# Altium project ZoM-Model-A.PrjPCB
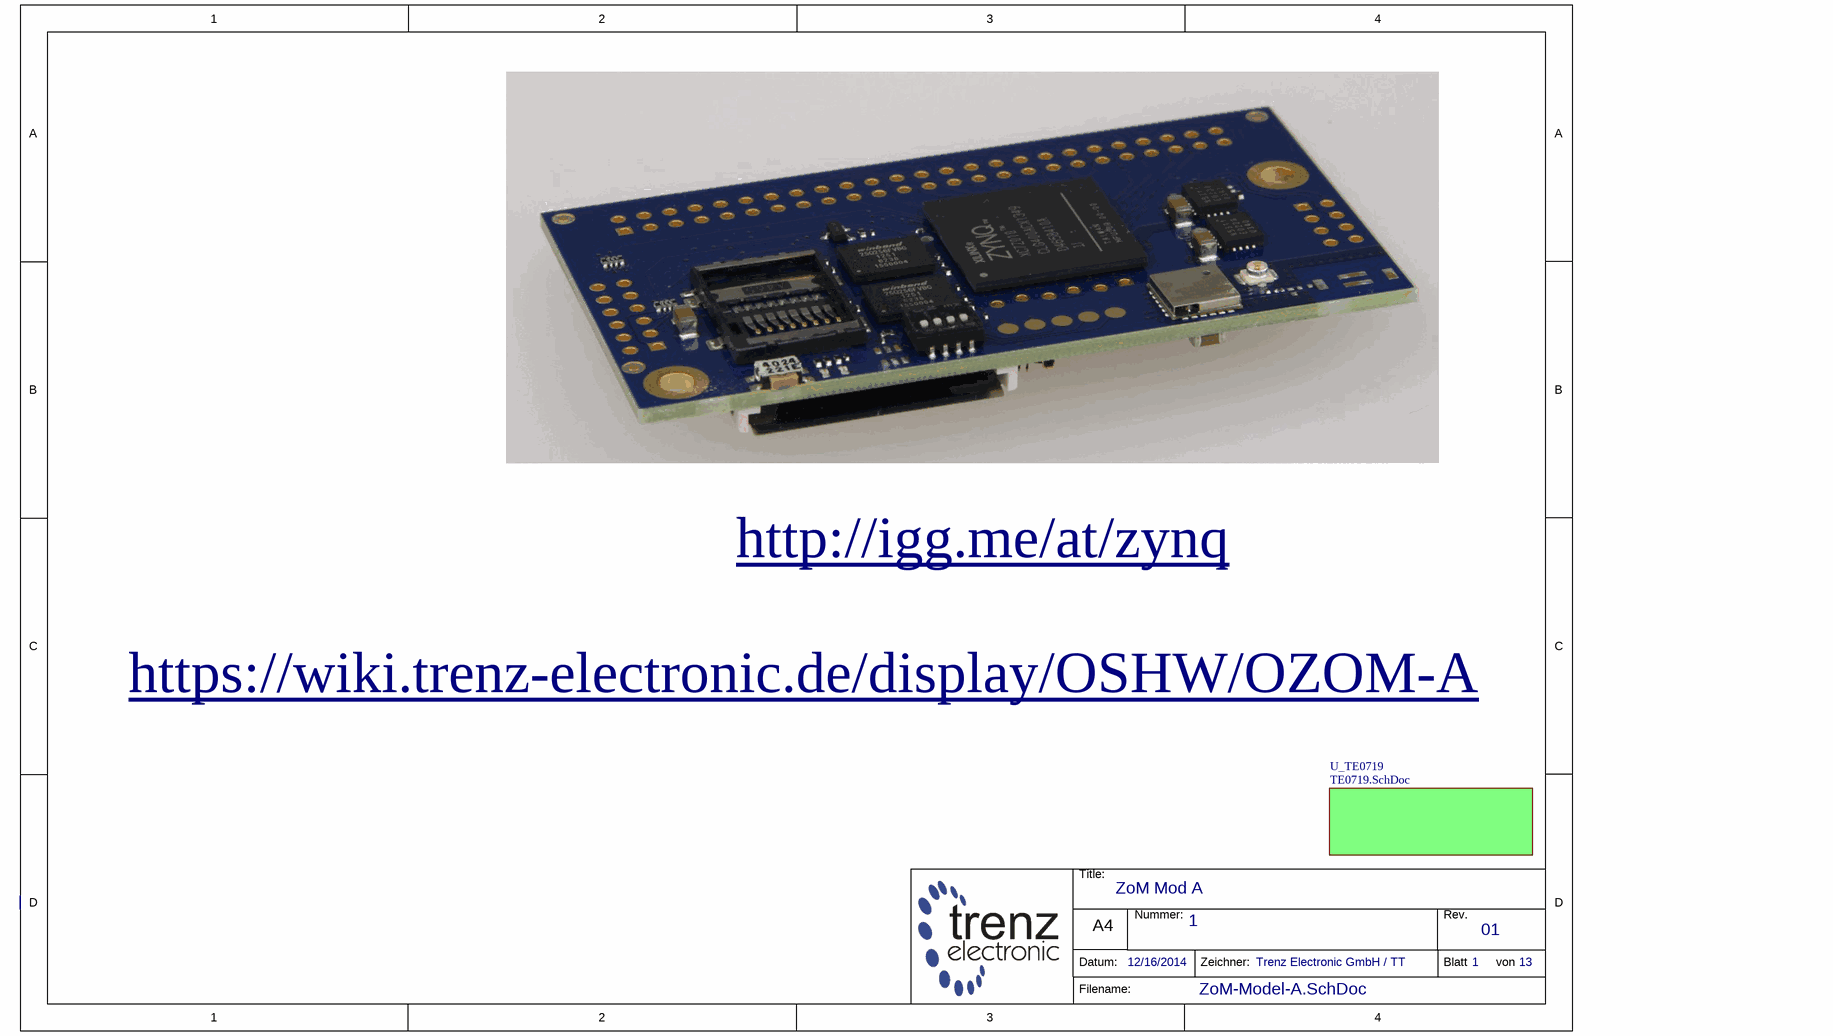
[diagram p0: ZoM-Model-A.SchDoc]
12 sheets, 136 parts. Net scope: global (net labels, ports and power ports of the same name join across sheets).
Board file: ZoM-Model-A.PcbDoc
Sheets:
  ZoM-Model-A.SchDoc
    U_TE0719 = TE0719.SchDoc
      U_FPGA = FPGA.SchDoc
        U_FPGA-Power = FPGA-Power.SchDoc
        U_FPGA-Misc = FPGA-Misc.SchDoc
        U_B13 = B13.SchDoc
        U_B34 = B34.SchDoc
        U_B35 = B35.SchDoc
        U_PS-DDR = PS-DDR.SchDoc
        U_PS_MIO = PS_MIO.SchDoc
      U_OBPeripheral = OBPeripheral.SchDoc
      U_POWER = POWER.SchDoc

## Sheet ZoM-Model-A.SchDoc: ZoM Mod A
size A4; Organization: Trenz Electronic GmbH / TT; DocumentNumber: 1; Revision: 01; SheetNumber: 1; SheetTotal: 13; Date: 12/16/2014

### Sub-sheets
U_TE0719 = TE0719.SchDoc: no entries

### Notes on the sheet
- http://igg.me/at/zynq
- https://wiki.trenz-electronic.de/display/OSHW/OZOM-A
- Title:
- Nummer:
- Rev.
- Datum:
- A4
- Zeichner:
- Blatt
- von
- Filename:

## Sheet TE0719.SchDoc: ZoM Mod A - Connectors
size A4; Organization: Trenz Electronic GmbH / TT; DocumentNumber: 2; Revision: 01; SheetNumber: 2; SheetTotal: 13; Date: 12/16/2014
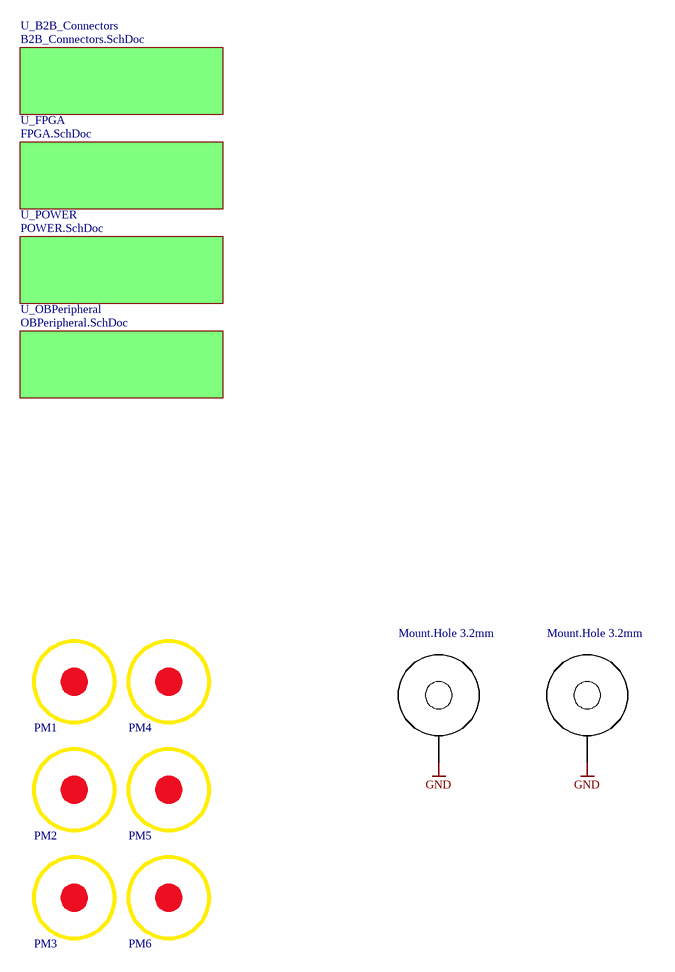
[diagram p1: TE0719.SchDoc]

### Parts
H1  Mount.Hole 3.2mm  [MHole3_2mm]  (no BOM)
H4  Mount.Hole 3.2mm  [MHole3_2mm]  (no BOM)
PM1  FIDU-DOT - small  [FIDU-DOT - small]  (value not drawn)
PM2  FIDU-DOT - small  [FIDU-DOT - small]  (value not drawn)
PM3  FIDU-DOT - small  [FIDU-DOT - small]  (value not drawn)
PM4  FIDU-DOT - small  [FIDU-DOT - small]  (value not drawn)
PM5  FIDU-DOT - small  [FIDU-DOT - small]  (value not drawn)
PM6  FIDU-DOT - small  [FIDU-DOT - small]  (value not drawn)

### Sub-sheets
U_B2B_Connectors = B2B_Connectors.SchDoc (file not in this document): no entries
U_FPGA = FPGA.SchDoc: no entries
U_OBPeripheral = OBPeripheral.SchDoc: no entries
U_POWER = POWER.SchDoc: no entries

### Nets
GND: H1.1 H4.1

### Notes on the sheet
- Title:
- Nummer:
- Rev.
- Datum:
- A4
- Zeichner:
- Blatt
- von
- Filename:

### Library data of the parts
H1 H4 = 22898: AN: 22898; Mixed: THT
PM1-PM6 = 22905: AN: 22905; Mixed: FIDU

## Sheet FPGA.SchDoc: ZoM Mod A - FPGA
size A4; Organization: Trenz Electronic GmbH; DocumentNumber: 5; Revision: 01; SheetNumber: 5; SheetTotal: 13; Date: 12/16/2014
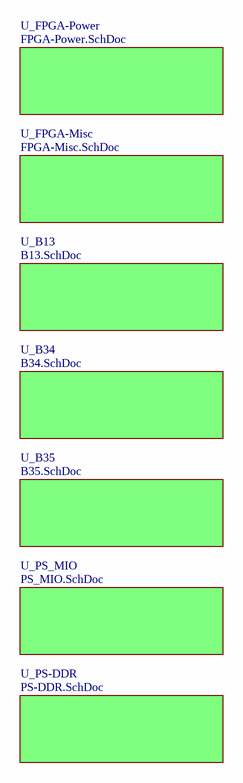
[diagram p2: FPGA.SchDoc]

### Sub-sheets
U_B13 = B13.SchDoc: no entries
U_B34 = B34.SchDoc: no entries
U_B35 = B35.SchDoc: no entries
U_FPGA-Misc = FPGA-Misc.SchDoc: no entries
U_FPGA-Power = FPGA-Power.SchDoc: no entries
U_PS-DDR = PS-DDR.SchDoc: no entries
U_PS_MIO = PS_MIO.SchDoc: no entries

### Notes on the sheet
- Title:
- Number:
- Rev.
- Date:
- A4
- Copyright:
- Page
- of
- Filename:

## Sheet FPGA-Power.SchDoc: ZoM Mod A - FPGA Power
size A4; Organization: Trenz Electronic GmbH / TT; DocumentNumber: 12; Revision: 01; SheetNumber: 12; SheetTotal: 13; Date: 12/16/2014
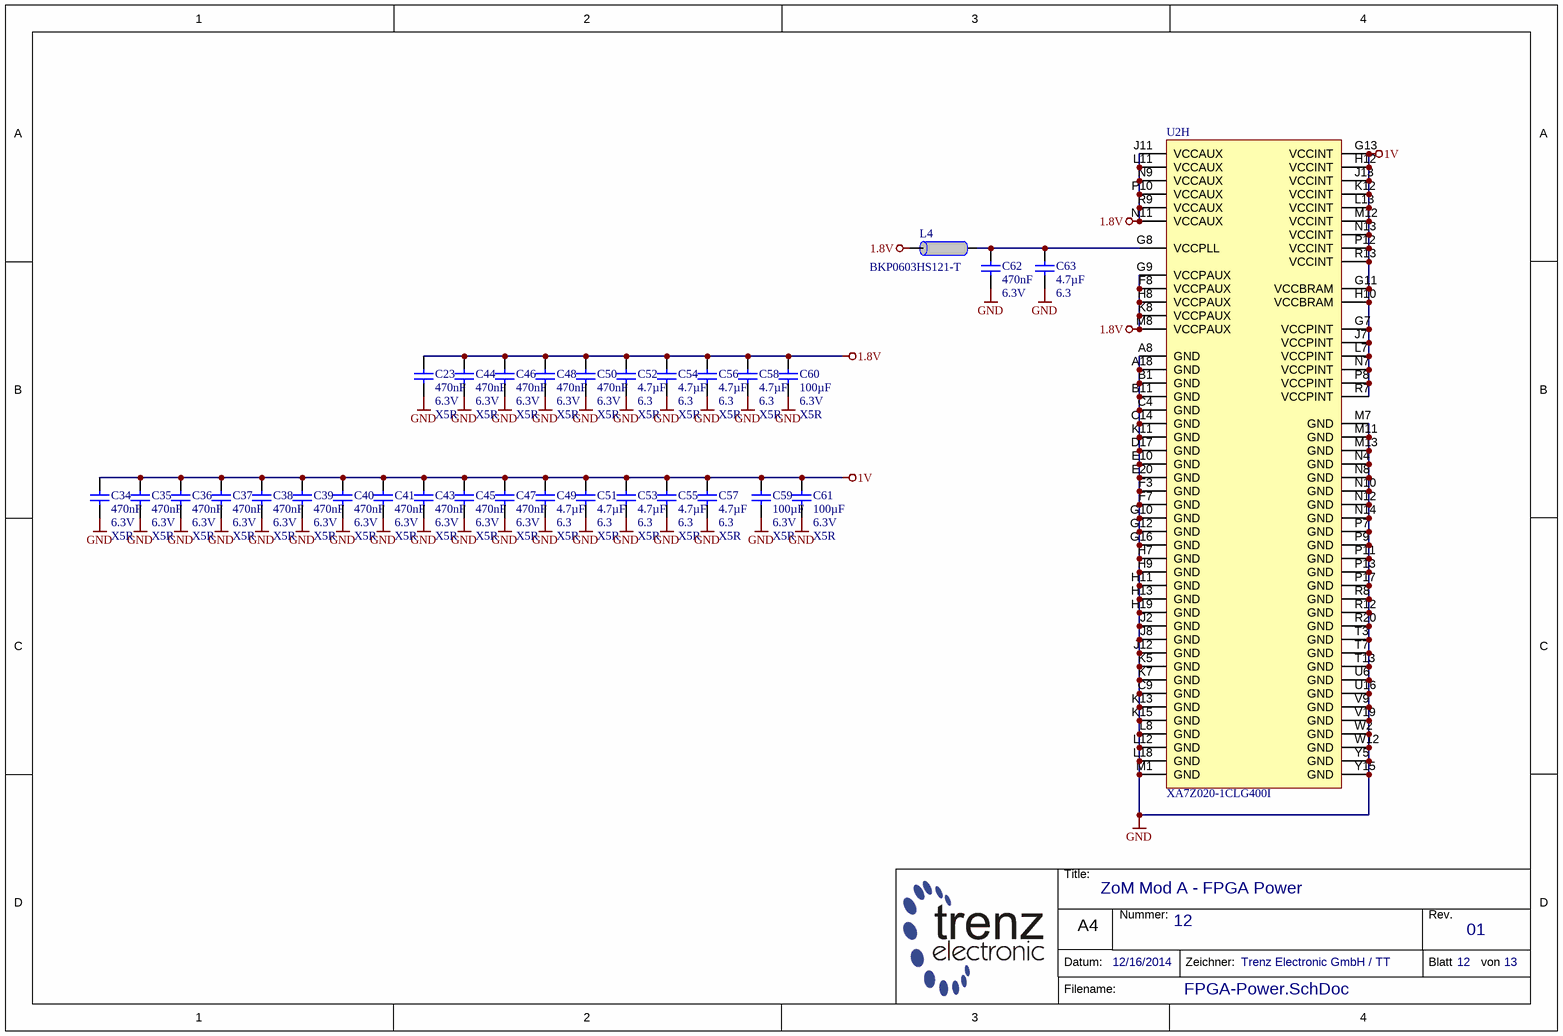
[diagram p3: FPGA-Power.SchDoc]

### Parts
C23  470nF  Voltage: 6.3V  Technology: X5R  [CAPC0603X33N]
C34  470nF  Voltage: 6.3V  Technology: X5R  [CAPC0603X33N]
C35  470nF  Voltage: 6.3V  Technology: X5R  [CAPC0603X33N]
C36  470nF  Voltage: 6.3V  Technology: X5R  [CAPC0603X33N]
C37  470nF  Voltage: 6.3V  Technology: X5R  [CAPC0603X33N]
C38  470nF  Voltage: 6.3V  Technology: X5R  [CAPC0603X33N]
C39  470nF  Voltage: 6.3V  Technology: X5R  [CAPC0603X33N]
C40  470nF  Voltage: 6.3V  Technology: X5R  [CAPC0603X33N]
C41  470nF  Voltage: 6.3V  Technology: X5R  [CAPC0603X33N]
C43  470nF  Voltage: 6.3V  Technology: X5R  [CAPC0603X33N]
C44  470nF  Voltage: 6.3V  Technology: X5R  [CAPC0603X33N]
C45  470nF  Voltage: 6.3V  Technology: X5R  [CAPC0603X33N]
C46  470nF  Voltage: 6.3V  Technology: X5R  [CAPC0603X33N]
C47  470nF  Voltage: 6.3V  Technology: X5R  [CAPC0603X33N]
C48  470nF  Voltage: 6.3V  Technology: X5R  [CAPC0603X33N]
C49  4.7µF  Voltage: 6.3  Technology: X5R  [CAPC1005X60N]
C50  470nF  Voltage: 6.3V  Technology: X5R  [CAPC0603X33N]
C51  4.7µF  Voltage: 6.3  Technology: X5R  [CAPC1005X60N]
C52  4.7µF  Voltage: 6.3  Technology: X5R  [CAPC1005X60N]
C53  4.7µF  Voltage: 6.3  Technology: X5R  [CAPC1005X60N]
C54  4.7µF  Voltage: 6.3  Technology: X5R  [CAPC1005X60N]
C55  4.7µF  Voltage: 6.3  Technology: X5R  [CAPC1005X60N]
C56  4.7µF  Voltage: 6.3  Technology: X5R  [CAPC1005X60N]
C57  4.7µF  Voltage: 6.3  Technology: X5R  [CAPC1005X60N]
C58  4.7µF  Voltage: 6.3  Technology: X5R  [CAPC1005X60N]
C59  100µF  Voltage: 6.3V  Technology: X5R  [CAPC3216X180N]
C60  100µF  Voltage: 6.3V  Technology: X5R  [CAPC3216X180N]
C61  100µF  Voltage: 6.3V  Technology: X5R  [CAPC3216X180N]
C62  470nF  Voltage: 6.3V  [CAPC0603X33N]
C63  4.7µF  Voltage: 6.3  [CAPC1005X60N]
L4  BKP0603HS121-T  [INDC0603X33N]
U2  XA7Z020-1CLG400I  [BGA400C80P20X20_1700X1700X160N]  (part H of 8)

### Nets
1.8V: C23.1 C44.1 C46.1 C48.1 C50.1 C52.1 C54.1 C56.1 C58.1 C60.2 L4.2 U2.F8(VCCPAUX) U2.G9(VCCPAUX) U2.H8(VCCPAUX) U2.J11(VCCAUX) U2.K8(VCCPAUX) U2.L11(VCCAUX) U2.M8(VCCPAUX) U2.N9(VCCAUX) U2.N11(VCCAUX) U2.P10(VCCAUX) U2.R9(VCCAUX)
1V: C34.1 C35.1 C36.1 C37.1 C38.1 C39.1 C40.1 C41.1 C43.1 C45.1 C47.1 C49.1 C51.1 C53.1 C55.1 C57.1 C59.1 C61.1 U2.G7(VCCPINT) U2.G11(VCCBRAM) U2.G13(VCCINT) U2.H10(VCCBRAM) U2.H12(VCCINT) U2.J7(VCCPINT) U2.J13(VCCINT) U2.K12(VCCINT) U2.L7(VCCPINT) U2.L13(VCCINT) U2.M12(VCCINT) U2.N7(VCCPINT) U2.N13(VCCINT) U2.P8(VCCPINT) U2.P12(VCCINT) U2.R7(VCCPINT) U2.R13(VCCINT)
GND: C23.2 C34.2 C35.2 C36.2 C37.2 C38.2 C39.2 C40.2 C41.2 C43.2 C44.2 C45.2 C46.2 C47.2 C48.2 C49.2 C50.2 C51.2 C52.2 C53.2 C54.2 C55.2 C56.2 C57.2 C58.2 C59.2 C60.1 C61.2 C62.2 C63.2 U2.A8(GND) U2.A18(GND) U2.B1(GND) U2.B11(GND) U2.C4(GND) U2.C9(GND) U2.C14(GND) U2.D17(GND) U2.E10(GND) U2.E20(GND) U2.F3(GND) U2.F7(GND) U2.G10(GND) U2.G12(GND) U2.G16(GND) U2.H7(GND) U2.H9(GND) U2.H11(GND) U2.H13(GND) U2.H19(GND) U2.J2(GND) U2.J8(GND) U2.J12(GND) U2.K5(GND) U2.K7(GND) U2.K11(GND) U2.K13(GND) U2.K15(GND) U2.L8(GND) U2.L12(GND) U2.L18(GND) U2.M1(GND) U2.M7(GND) U2.M11(GND) U2.M13(GND) U2.N4(GND) U2.N8(GND) U2.N10(GND) U2.N12(GND) U2.N14(GND) U2.P7(GND) U2.P9(GND) U2.P11(GND) U2.P13(GND) U2.P17(GND) U2.R8(GND) U2.R12(GND) U2.R20(GND) U2.T3(GND) U2.T7(GND) U2.T13(GND) U2.U6(GND) U2.U16(GND) U2.V9(GND) U2.V19(GND) U2.W2(GND) U2.W12(GND) U2.Y5(GND) U2.Y15(GND)
NetC62_1: C62.1 C63.1 L4.1 U2.G8(VCCPLL)

### Notes on the sheet
- Title:
- Nummer:
- Rev.
- Datum:
- A4
- Zeichner:
- Blatt
- von
- Filename:

### Library data of the parts
C23 C34-C41 C43-C48 C50 = 24921: KON 470nF X5R 6.3V SMD; AN: 24921; Value: 470n; Tolerance: 20%; Mixed: SMT; Preferred: Yes; Case: 0603 (0201)
C49 C51-C58 = 24719: KON 4.7µF 6.3V X5R SMD; AN: 24719; Value: 4.7u; Mixed: SMT; Preferred: Yes; Case: 1005 (0402)
C59-C61 = 23116: KON 100µF 6,3V X5R SMD; AN: 23116; Value: 100u; Mixed: SMT; Preferred: Yes; Case: 3216 (1206)
C62 = 24921: KON 470nF X5R 6.3V SMD; AN: 24921; Tolerance: 20%; Mixed: SMT; Value: 470n; Preferred: Yes; Technology: X5R; Case: 0603 (0201)
C63 = 24719: KON 4.7µF 6.3V X5R SMD; AN: 24719; Mixed: SMT; Value: 4.7u; Preferred: Yes; Technology: X5R; Case: 1005 (0402)
L4 = 25393: Ferritdurchführung SMD 0201; AN: 25393; Trenz-Stock: Yes; Mixed: SMT; Case: 0603 (0201); HelpURL: B:\AD\adlib\datasheet\MULTILAYER CHIP BEAD INDUCTORS BK; Preferred: Yes
U2 = 25981: AN: 25981; Mixed: SMT; Trenz-Stock: Yes; Case: CLG400; HelpURL: B:\AD\adlib\datasheet\XC7

## Sheet FPGA-Misc.SchDoc: ZoM Mod A - FPGA MIsc
size A4; Organization: Trenz Electronic GmbH / TT; DocumentNumber: 11; Revision: 01; SheetNumber: 11; SheetTotal: 13; Date: 12/16/2014
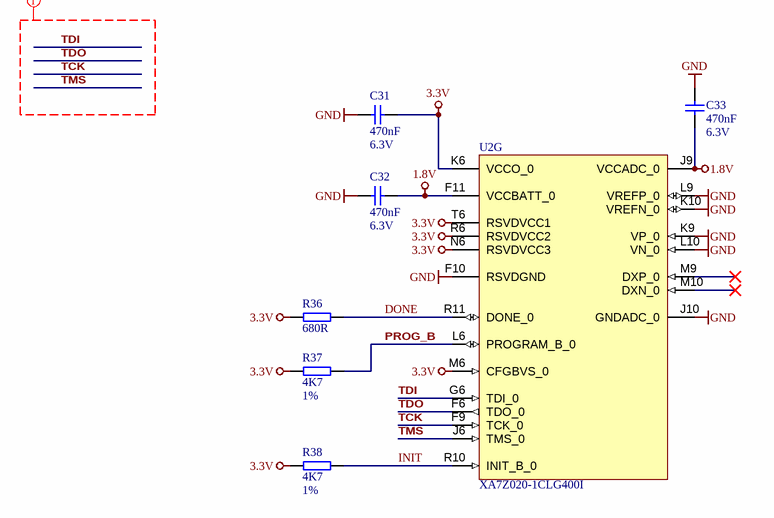
[diagram p4: FPGA-Misc.SchDoc]

### Parts
C31  470nF  Voltage: 6.3V  [CAPC0603X33N]
C32  470nF  Voltage: 6.3V  [CAPC0603X33N]
C33  470nF  Voltage: 6.3V  [CAPC0603X33N]
R36  680R  [RESC1005X40N]
R37  4K7  Tolerance: 1%  [RESC0603X26N]
R38  4K7  Tolerance: 1%  [RESC0603X26N]
U2  XA7Z020-1CLG400I  [BGA400C80P20X20_1700X1700X160N]  (part G of 8)

### Nets
1.8V: C32.2 C33.2 U2.F11(VCCBATT_0) U2.J9(VCCADC_0)
3.3V: C31.2 R36.1 R37.2 R38.2 U2.K6(VCCO_0) U2.M6(CFGBVS_0) U2.N6(RSVDVCC3) U2.R6(RSVDVCC2) U2.T6(RSVDVCC1)
GND: C31.1 C32.1 C33.1 U2.F10(RSVDGND) U2.J10(GNDADC_0) U2.K9(VP_0) U2.K10(VREFN_0) U2.L9(VREFP_0) U2.L10(VN_0)
DONE: R36.2 U2.R11(DONE_0)
INIT: R38.1 U2.R10(INIT_B_0)
PROG_B: R37.1 U2.L6(PROGRAM_B_0)
TCK: U2.F9(TCK_0)
TDI: U2.G6(TDI_0)
TDO: U2.F6(TDO_0)
TMS: U2.J6(TMS_0)

Not connected (* = marked no-connect by the designer): U2 M9(DXP_0)* M10(DXN_0)*

### Layout directives
net class JTAG: TCK, TDI, TDO, TMS

### Notes on the sheet
- Title:
- Nummer:
- Rev.
- Datum:
- A4
- Zeichner:
- Blatt
- von
- Filename:

### Library data of the parts
C31-C33 = 24921: as C23 on sheet FPGA-Power; Case: 0603 (0201); Technology: X5R
R36 = 22761: WID SMD 680R 1% 0,063W; AN: 22761; Value: 680; Mixed: SMT; Preferred: Yes; Case: 1005 (0402)
R37 R38 = 25242: WID SMD 4K7 1% 0,05W; AN: 25242; Value: 4.7K; Mixed: SMT; Preferred: Yes; Case: 0603 (0201); HelpURL: B:\AD\adlib\datasheet\R0201
U2 = 25981: AN: 25981; Mixed: SMT; Trenz-Stock: Yes; Case: CLG400; HelpURL: B:\AD\adlib\datasheet\XC7

## Sheet B13.SchDoc: ZoM Mod A - FPGA Bank 13
size A4; Organization: Trenz Electronic GmbH / TT; DocumentNumber: 6; Revision: 01; SheetNumber: 6; SheetTotal: 13; Date: 12/16/2014
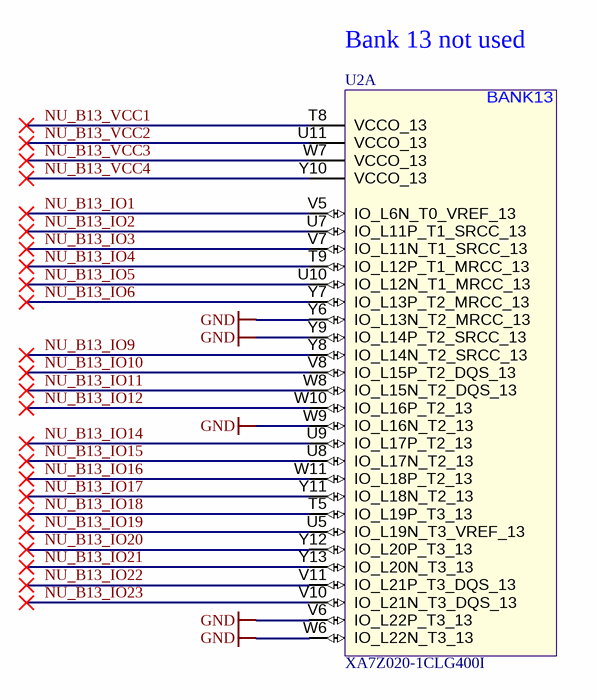
[diagram p5: B13.SchDoc]

### Parts
U2  XA7Z020-1CLG400I  [BGA400C80P20X20_1700X1700X160N]  (part A of 8)

### Nets
GND: U2.V6(IO_L22P_T3_13) U2.W6(IO_L22N_T3_13) U2.W9(IO_L16N_T2_13) U2.Y6(IO_L13N_T2_MRCC_13) U2.Y9(IO_L14P_T2_SRCC_13)
NU_B13_IO1: U2.V5(IO_L6N_T0_VREF_13)
NU_B13_IO2: U2.U7(IO_L11P_T1_SRCC_13)
NU_B13_IO3: U2.V7(IO_L11N_T1_SRCC_13)
NU_B13_IO4: U2.T9(IO_L12P_T1_MRCC_13)
NU_B13_IO5: U2.U10(IO_L12N_T1_MRCC_13)
NU_B13_IO6: U2.Y7(IO_L13P_T2_MRCC_13)
NU_B13_IO9: U2.Y8(IO_L14N_T2_SRCC_13)
NU_B13_IO10: U2.V8(IO_L15P_T2_DQS_13)
NU_B13_IO11: U2.W8(IO_L15N_T2_DQS_13)
NU_B13_IO12: U2.W10(IO_L16P_T2_13)
NU_B13_IO14: U2.U9(IO_L17P_T2_13)
NU_B13_IO15: U2.U8(IO_L17N_T2_13)
NU_B13_IO16: U2.W11(IO_L18P_T2_13)
NU_B13_IO17: U2.Y11(IO_L18N_T2_13)
NU_B13_IO18: U2.T5(IO_L19P_T3_13)
NU_B13_IO19: U2.U5(IO_L19N_T3_VREF_13)
NU_B13_IO20: U2.Y12(IO_L20P_T3_13)
NU_B13_IO21: U2.Y13(IO_L20N_T3_13)
NU_B13_IO22: U2.V11(IO_L21P_T3_DQS_13)
NU_B13_IO23: U2.V10(IO_L21N_T3_DQS_13)
NU_B13_VCC1: U2.T8(VCCO_13)
NU_B13_VCC2: U2.U11(VCCO_13)
NU_B13_VCC3: U2.W7(VCCO_13)
NU_B13_VCC4: U2.Y10(VCCO_13)

### Notes on the sheet
- Bank 13 not used
- Title:
- Nummer:
- Rev.
- Datum:
- A4
- Zeichner:
- Blatt
- von
- Filename:
- (in symbol 25981, part A) BANK13

### Library data of the parts
U2 = 25981: AN: 25981; Mixed: SMT; Trenz-Stock: Yes; Case: CLG400; HelpURL: B:\AD\adlib\datasheet\XC7

## Sheet B34.SchDoc: ZoM Mod A - FPGA Bank 34
size A4; Organization: Trenz Electronic GmbH / TT; DocumentNumber: 7; Revision: 01; SheetNumber: 7; SheetTotal: 13; Date: 12/16/2014
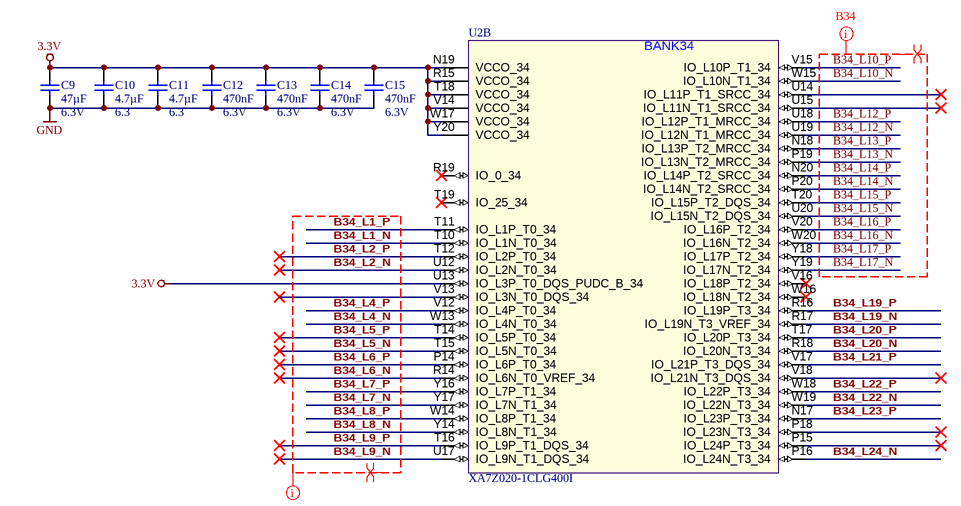
[diagram p6: B34.SchDoc]

### Parts
C9  47µF  Voltage: 6.3V  [CAPC3216X180N]
C10  4.7µF  Voltage: 6.3  [CAPC1005X60N]
C11  4.7µF  Voltage: 6.3  [CAPC1005X60N]
C12  470nF  Voltage: 6.3V  [CAPC0603X33N]
C13  470nF  Voltage: 6.3V  [CAPC0603X33N]
C14  470nF  Voltage: 6.3V  [CAPC0603X33N]
C15  470nF  Voltage: 6.3V  [CAPC0603X33N]
U2  XA7Z020-1CLG400I  [BGA400C80P20X20_1700X1700X160N]  (part B of 8)

### Nets
3.3V: C9.1 C10.1 C11.1 C12.1 C13.1 C14.1 C15.1 U2.N19(VCCO_34) U2.R15(VCCO_34) U2.T18(VCCO_34) U2.U13(IO_L3P_T0_DQS_PUDC_B_34) U2.V14(VCCO_34) U2.W17(VCCO_34) U2.Y20(VCCO_34)
GND: C9.2 C10.2 C11.2 C12.2 C13.2 C14.2 C15.2
B34_L1_N: U2.T10(IO_L1N_T0_34)
B34_L1_P: U2.T11(IO_L1P_T0_34)
B34_L2_N: U2.U12(IO_L2N_T0_34)
B34_L2_P: U2.T12(IO_L2P_T0_34)
B34_L4_N: U2.W13(IO_L4N_T0_34)
B34_L4_P: U2.V12(IO_L4P_T0_34)
B34_L5_N: U2.T15(IO_L5N_T0_34)
B34_L5_P: U2.T14(IO_L5P_T0_34)
B34_L6_N: U2.R14(IO_L6N_T0_VREF_34)
B34_L6_P: U2.P14(IO_L6P_T0_34)
B34_L7_N: U2.Y17(IO_L7N_T1_34)
B34_L7_P: U2.Y16(IO_L7P_T1_34)
B34_L8_N: U2.Y14(IO_L8N_T1_34)
B34_L8_P: U2.W14(IO_L8P_T1_34)
B34_L9_N: U2.U17(IO_L9N_T1_DQS_34)
B34_L9_P: U2.T16(IO_L9P_T1_DQS_34)
B34_L10_N: U2.W15(IO_L10N_T1_34)
B34_L10_P: U2.V15(IO_L10P_T1_34)
B34_L12_N: U2.U19(IO_L12N_T1_MRCC_34)
B34_L12_P: U2.U18(IO_L12P_T1_MRCC_34)
B34_L13_N: U2.P19(IO_L13N_T2_MRCC_34)
B34_L13_P: U2.N18(IO_L13P_T2_MRCC_34)
B34_L14_N: U2.P20(IO_L14N_T2_SRCC_34)
B34_L14_P: U2.N20(IO_L14P_T2_SRCC_34)
B34_L15_N: U2.U20(IO_L15N_T2_DQS_34)
B34_L15_P: U2.T20(IO_L15P_T2_DQS_34)
B34_L16_N: U2.W20(IO_L16N_T2_34)
B34_L16_P: U2.V20(IO_L16P_T2_34)
B34_L17_N: U2.Y19(IO_L17N_T2_34)
B34_L17_P: U2.Y18(IO_L17P_T2_34)
B34_L19_N: U2.R17(IO_L19N_T3_VREF_34)
B34_L19_P: U2.R16(IO_L19P_T3_34)
B34_L20_N: U2.R18(IO_L20N_T3_34)
B34_L20_P: U2.T17(IO_L20P_T3_34)
B34_L21_P: U2.V17(IO_L21P_T3_DQS_34)
B34_L22_N: U2.W19(IO_L22N_T3_34)
B34_L22_P: U2.W18(IO_L22P_T3_34)
B34_L23_P: U2.N17(IO_L23P_T3_34)
B34_L24_N: U2.P16(IO_L24N_T3_34)

Not connected (* = marked no-connect by the designer): U2 P15(IO_L24P_T3_34)* P18(IO_L23N_T3_34)* R19(IO_0_34)* T19(IO_25_34)* U14(IO_L11P_T1_SRCC_34)* U15(IO_L11N_T1_SRCC_34)* V13(IO_L3N_T0_DQS_34)* V16(IO_L18P_T2_34)* V18(IO_L21N_T3_DQS_34)* W16(IO_L18N_T2_34)*

### Layout directives
differential pair: B34_L1_N, B34_L1_P, B34_L2_N, B34_L2_P, B34_L4_N, B34_L4_P, B34_L5_N, B34_L5_P, B34_L6_N, B34_L6_P, B34_L7_N, B34_L7_P, B34_L8_N, B34_L8_P, B34_L9_N, B34_L9_P, B34_L10_N, B34_L10_P, B34_L12_N, B34_L12_P, B34_L13_N, B34_L13_P, B34_L14_N, B34_L14_P, B34_L15_N, B34_L15_P, B34_L16_N, B34_L16_P, B34_L17_N, B34_L17_P
net class B34: B34_L1_N, B34_L1_P, B34_L2_N, B34_L2_P, B34_L4_N, B34_L4_P, B34_L5_N, B34_L5_P, B34_L6_N, B34_L6_P, B34_L7_N, B34_L7_P, B34_L8_N, B34_L8_P, B34_L9_N, B34_L9_P, B34_L10_N, B34_L10_P, B34_L12_N, B34_L12_P, B34_L13_N, B34_L13_P, B34_L14_N, B34_L14_P, B34_L15_N, B34_L15_P, B34_L16_N, B34_L16_P, B34_L17_N, B34_L17_P

### Notes on the sheet
- Title:
- Nummer:
- Rev.
- Datum:
- A4
- Zeichner:
- Blatt
- von
- Filename:
- (in symbol 25981, part B) BANK34

### Library data of the parts
C9 = 24557: KON 47µF 6.3V  X5R SMD 20%; AN: 24557; Mixed: SMT; Value: 47u; Preferred: Yes; Technology: X5R; Case: 3216 (1206); Tolerance: 20%
C10 C11 = 24719: as C49 on sheet FPGA-Power; Case: 1005 (0402); Technology: X5R
C12-C15 = 24921: as C23 on sheet FPGA-Power; Case: 0603 (0201); Technology: X5R
U2 = 25981: AN: 25981; Mixed: SMT; Trenz-Stock: Yes; Case: CLG400; HelpURL: B:\AD\adlib\datasheet\XC7

## Sheet B35.SchDoc: ZoM Mod A - FPGA Bank 35
size A4; Organization: Trenz Electronic GmbH / TT; DocumentNumber: 8; Revision: 01; SheetNumber: 8; SheetTotal: 13; Date: 12/16/2014
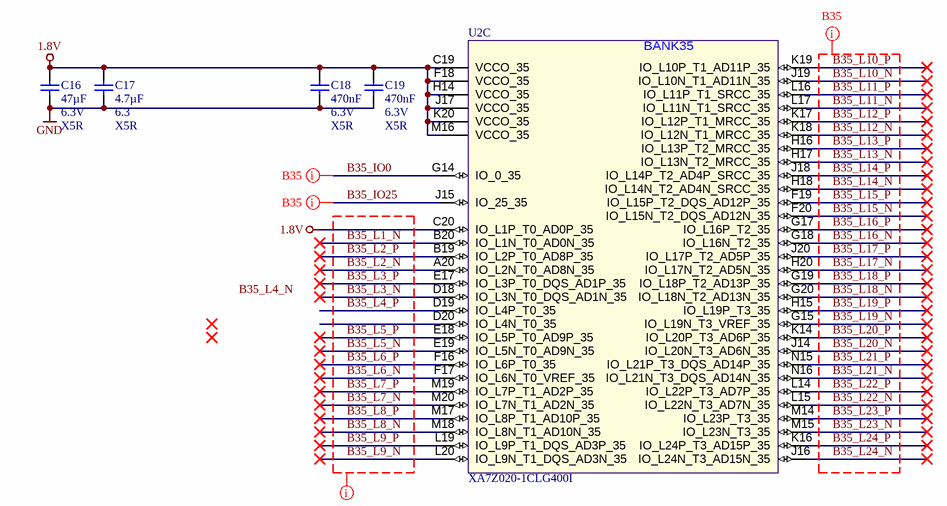
[diagram p7: B35.SchDoc]

### Parts
C16  47µF  Voltage: 6.3V  Technology: X5R  [CAPC3216X180N]
C17  4.7µF  Voltage: 6.3  Technology: X5R  [CAPC1005X60N]
C18  470nF  Voltage: 6.3V  Technology: X5R  [CAPC0603X33N]
C19  470nF  Voltage: 6.3V  Technology: X5R  [CAPC0603X33N]
U2  XA7Z020-1CLG400I  [BGA400C80P20X20_1700X1700X160N]  (part C of 8)

### Nets
1.8V: C16.1 C17.1 C18.1 C19.1 U2.C19(VCCO_35) U2.C20(IO_L1P_T0_AD0P_35) U2.F18(VCCO_35) U2.H14(VCCO_35) U2.J17(VCCO_35) U2.K20(VCCO_35) U2.M16(VCCO_35)
GND: C16.2 C17.2 C18.2 C19.2
B35_IO0: U2.G14(IO_0_35)
B35_IO25: U2.J15(IO_25_35)
B35_L1_N: U2.B20(IO_L1N_T0_AD0N_35)
B35_L2_N: U2.A20(IO_L2N_T0_AD8N_35)
B35_L2_P: U2.B19(IO_L2P_T0_AD8P_35)
B35_L3_N: U2.D18(IO_L3N_T0_DQS_AD1N_35)
B35_L3_P: U2.E17(IO_L3P_T0_DQS_AD1P_35)
B35_L4_P: U2.D19(IO_L4P_T0_35)
B35_L5_N: U2.E19(IO_L5N_T0_AD9N_35)
B35_L5_P: U2.E18(IO_L5P_T0_AD9P_35)
B35_L6_N: U2.F17(IO_L6N_T0_VREF_35)
B35_L6_P: U2.F16(IO_L6P_T0_35)
B35_L7_N: U2.M20(IO_L7N_T1_AD2N_35)
B35_L7_P: U2.M19(IO_L7P_T1_AD2P_35)
B35_L8_N: U2.M18(IO_L8N_T1_AD10N_35)
B35_L8_P: U2.M17(IO_L8P_T1_AD10P_35)
B35_L9_N: U2.L20(IO_L9N_T1_DQS_AD3N_35)
B35_L9_P: U2.L19(IO_L9P_T1_DQS_AD3P_35)
B35_L10_N: U2.J19(IO_L10N_T1_AD11N_35)
B35_L10_P: U2.K19(IO_L10P_T1_AD11P_35)
B35_L11_N: U2.L17(IO_L11N_T1_SRCC_35)
B35_L11_P: U2.L16(IO_L11P_T1_SRCC_35)
B35_L12_N: U2.K18(IO_L12N_T1_MRCC_35)
B35_L12_P: U2.K17(IO_L12P_T1_MRCC_35)
B35_L13_N: U2.H17(IO_L13N_T2_MRCC_35)
B35_L13_P: U2.H16(IO_L13P_T2_MRCC_35)
B35_L14_N: U2.H18(IO_L14N_T2_AD4N_SRCC_35)
B35_L14_P: U2.J18(IO_L14P_T2_AD4P_SRCC_35)
B35_L15_N: U2.F20(IO_L15N_T2_DQS_AD12N_35)
B35_L15_P: U2.F19(IO_L15P_T2_DQS_AD12P_35)
B35_L16_N: U2.G18(IO_L16N_T2_35)
B35_L16_P: U2.G17(IO_L16P_T2_35)
B35_L17_N: U2.H20(IO_L17N_T2_AD5N_35)
B35_L17_P: U2.J20(IO_L17P_T2_AD5P_35)
B35_L18_N: U2.G20(IO_L18N_T2_AD13N_35)
B35_L18_P: U2.G19(IO_L18P_T2_AD13P_35)
B35_L19_N: U2.G15(IO_L19N_T3_VREF_35)
B35_L19_P: U2.H15(IO_L19P_T3_35)
B35_L20_N: U2.J14(IO_L20N_T3_AD6N_35)
B35_L20_P: U2.K14(IO_L20P_T3_AD6P_35)
B35_L21_N: U2.N16(IO_L21N_T3_DQS_AD14N_35)
B35_L21_P: U2.N15(IO_L21P_T3_DQS_AD14P_35)
B35_L22_N: U2.L15(IO_L22N_T3_AD7N_35)
B35_L22_P: U2.L14(IO_L22P_T3_AD7P_35)
B35_L23_N: U2.M15(IO_L23N_T3_35)
B35_L23_P: U2.M14(IO_L23P_T3_35)
B35_L24_N: U2.J16(IO_L24N_T3_AD15N_35)
B35_L24_P: U2.K16(IO_L24P_T3_AD15P_35)

Not connected (* = marked no-connect by the designer): U2 D20(IO_L4N_T0_35)

### Layout directives
net class B35: B35_IO0, B35_IO25, B35_L1_N, B35_L2_N, B35_L2_P, B35_L3_N, B35_L3_P, B35_L4_P, B35_L5_N, B35_L5_P, B35_L6_N, B35_L6_P, B35_L7_N, B35_L7_P, B35_L8_N, B35_L8_P, B35_L9_N, B35_L9_P, B35_L10_N, B35_L10_P, B35_L11_N, B35_L11_P, B35_L12_N, B35_L12_P, B35_L13_N, B35_L13_P, B35_L14_N, B35_L14_P, B35_L15_N, B35_L15_P, B35_L16_N, B35_L16_P, B35_L17_N, B35_L17_P, B35_L18_N, B35_L18_P, B35_L19_N, B35_L19_P, B35_L20_N, B35_L20_P, B35_L21_N, B35_L21_P, B35_L22_N, B35_L22_P, B35_L23_N, B35_L23_P, B35_L24_N, B35_L24_P

### Notes on the sheet
- Labels drawn without touching a wire or pin: B35_L4_N
- Title:
- Nummer:
- Rev.
- Datum:
- A4
- Zeichner:
- Blatt
- von
- Filename:
- (in symbol 25981, part C) BANK35

### Library data of the parts
C16 = 24557: as C9 on sheet B34; Case: 3216 (1206); Tolerance: 20%
C17 = 24719: as C49 on sheet FPGA-Power; Case: 1005 (0402)
C18 C19 = 24921: as C23 on sheet FPGA-Power; Case: 0603 (0201)
U2 = 25981: AN: 25981; Mixed: SMT; Trenz-Stock: Yes; Case: CLG400; HelpURL: B:\AD\adlib\datasheet\XC7

## Sheet PS-DDR.SchDoc: ZoM Mod A - FPGA DDR Bank
size A4; Organization: Trenz Electronic GmbH / TT; DocumentNumber: 10; Revision: 01; SheetNumber: 10; SheetTotal: 13; Date: 12/16/2014
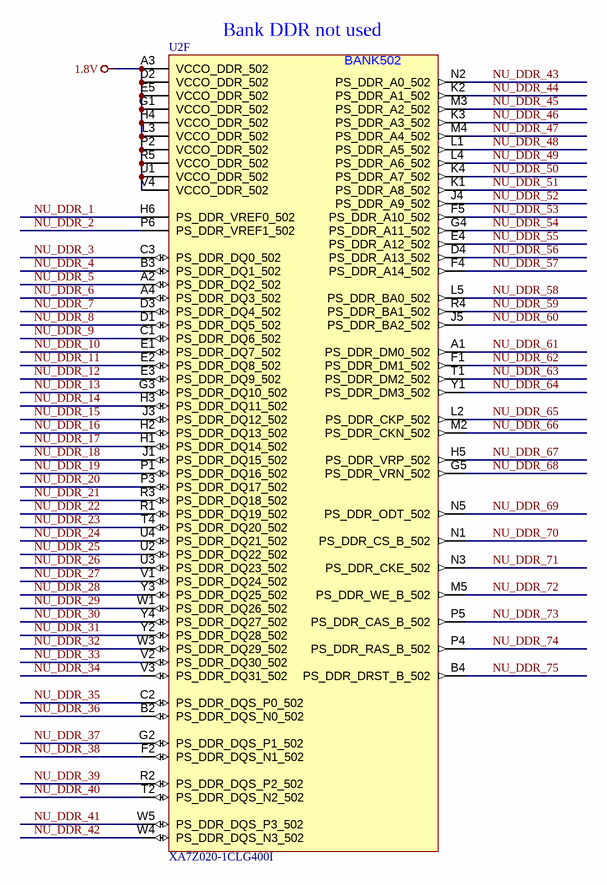
[diagram p8: PS-DDR.SchDoc]

### Parts
U2  XA7Z020-1CLG400I  [BGA400C80P20X20_1700X1700X160N]  (part F of 8)

### Nets
1.8V: U2.A3(VCCO_DDR_502) U2.D2(VCCO_DDR_502) U2.E5(VCCO_DDR_502) U2.G1(VCCO_DDR_502) U2.H4(VCCO_DDR_502) U2.L3(VCCO_DDR_502) U2.P2(VCCO_DDR_502) U2.R5(VCCO_DDR_502) U2.U1(VCCO_DDR_502) U2.V4(VCCO_DDR_502)
NU_DDR_1: U2.H6(PS_DDR_VREF0_502)
NU_DDR_2: U2.P6(PS_DDR_VREF1_502)
NU_DDR_3: U2.C3(PS_DDR_DQ0_502)
NU_DDR_4: U2.B3(PS_DDR_DQ1_502)
NU_DDR_5: U2.A2(PS_DDR_DQ2_502)
NU_DDR_6: U2.A4(PS_DDR_DQ3_502)
NU_DDR_7: U2.D3(PS_DDR_DQ4_502)
NU_DDR_8: U2.D1(PS_DDR_DQ5_502)
NU_DDR_9: U2.C1(PS_DDR_DQ6_502)
NU_DDR_10: U2.E1(PS_DDR_DQ7_502)
NU_DDR_11: U2.E2(PS_DDR_DQ8_502)
NU_DDR_12: U2.E3(PS_DDR_DQ9_502)
NU_DDR_13: U2.G3(PS_DDR_DQ10_502)
NU_DDR_14: U2.H3(PS_DDR_DQ11_502)
NU_DDR_15: U2.J3(PS_DDR_DQ12_502)
NU_DDR_16: U2.H2(PS_DDR_DQ13_502)
NU_DDR_17: U2.H1(PS_DDR_DQ14_502)
NU_DDR_18: U2.J1(PS_DDR_DQ15_502)
NU_DDR_19: U2.P1(PS_DDR_DQ16_502)
NU_DDR_20: U2.P3(PS_DDR_DQ17_502)
NU_DDR_21: U2.R3(PS_DDR_DQ18_502)
NU_DDR_22: U2.R1(PS_DDR_DQ19_502)
NU_DDR_23: U2.T4(PS_DDR_DQ20_502)
NU_DDR_24: U2.U4(PS_DDR_DQ21_502)
NU_DDR_25: U2.U2(PS_DDR_DQ22_502)
NU_DDR_26: U2.U3(PS_DDR_DQ23_502)
NU_DDR_27: U2.V1(PS_DDR_DQ24_502)
NU_DDR_28: U2.Y3(PS_DDR_DQ25_502)
NU_DDR_29: U2.W1(PS_DDR_DQ26_502)
NU_DDR_30: U2.Y4(PS_DDR_DQ27_502)
NU_DDR_31: U2.Y2(PS_DDR_DQ28_502)
NU_DDR_32: U2.W3(PS_DDR_DQ29_502)
NU_DDR_33: U2.V2(PS_DDR_DQ30_502)
NU_DDR_34: U2.V3(PS_DDR_DQ31_502)
NU_DDR_35: U2.C2(PS_DDR_DQS_P0_502)
NU_DDR_36: U2.B2(PS_DDR_DQS_N0_502)
NU_DDR_37: U2.G2(PS_DDR_DQS_P1_502)
NU_DDR_38: U2.F2(PS_DDR_DQS_N1_502)
NU_DDR_39: U2.R2(PS_DDR_DQS_P2_502)
NU_DDR_40: U2.T2(PS_DDR_DQS_N2_502)
NU_DDR_41: U2.W5(PS_DDR_DQS_P3_502)
NU_DDR_42: U2.W4(PS_DDR_DQS_N3_502)
NU_DDR_43: U2.N2(PS_DDR_A0_502)
NU_DDR_44: U2.K2(PS_DDR_A1_502)
NU_DDR_45: U2.M3(PS_DDR_A2_502)
NU_DDR_46: U2.K3(PS_DDR_A3_502)
NU_DDR_47: U2.M4(PS_DDR_A4_502)
NU_DDR_48: U2.L1(PS_DDR_A5_502)
NU_DDR_49: U2.L4(PS_DDR_A6_502)
NU_DDR_50: U2.K4(PS_DDR_A7_502)
NU_DDR_51: U2.K1(PS_DDR_A8_502)
NU_DDR_52: U2.J4(PS_DDR_A9_502)
NU_DDR_53: U2.F5(PS_DDR_A10_502)
NU_DDR_54: U2.G4(PS_DDR_A11_502)
NU_DDR_55: U2.E4(PS_DDR_A12_502)
NU_DDR_56: U2.D4(PS_DDR_A13_502)
NU_DDR_57: U2.F4(PS_DDR_A14_502)
NU_DDR_58: U2.L5(PS_DDR_BA0_502)
NU_DDR_59: U2.R4(PS_DDR_BA1_502)
NU_DDR_60: U2.J5(PS_DDR_BA2_502)
NU_DDR_61: U2.A1(PS_DDR_DM0_502)
NU_DDR_62: U2.F1(PS_DDR_DM1_502)
NU_DDR_63: U2.T1(PS_DDR_DM2_502)
NU_DDR_64: U2.Y1(PS_DDR_DM3_502)
NU_DDR_65: U2.L2(PS_DDR_CKP_502)
NU_DDR_66: U2.M2(PS_DDR_CKN_502)
NU_DDR_67: U2.H5(PS_DDR_VRP_502)
NU_DDR_68: U2.G5(PS_DDR_VRN_502)
NU_DDR_69: U2.N5(PS_DDR_ODT_502)
NU_DDR_70: U2.N1(PS_DDR_CS_B_502)
NU_DDR_71: U2.N3(PS_DDR_CKE_502)
NU_DDR_72: U2.M5(PS_DDR_WE_B_502)
NU_DDR_73: U2.P5(PS_DDR_CAS_B_502)
NU_DDR_74: U2.P4(PS_DDR_RAS_B_502)
NU_DDR_75: U2.B4(PS_DDR_DRST_B_502)

### Notes on the sheet
- (near U2) Bank DDR not used
- Title:
- Nummer:
- Rev.
- Datum:
- A4
- Zeichner:
- Blatt
- von
- Filename:
- (in symbol 25981, part F) BANK502

### Library data of the parts
U2 = 25981: AN: 25981; Mixed: SMT; Trenz-Stock: Yes; Case: CLG400; HelpURL: B:\AD\adlib\datasheet\XC7

## Sheet PS_MIO.SchDoc: ZoM Mod A - FPGA MIO Banks
size A4; Organization: Trenz Electronic GmbH / TT; DocumentNumber: 9; Revision: 01; SheetNumber: 9; SheetTotal: 13; Date: 12/16/2014
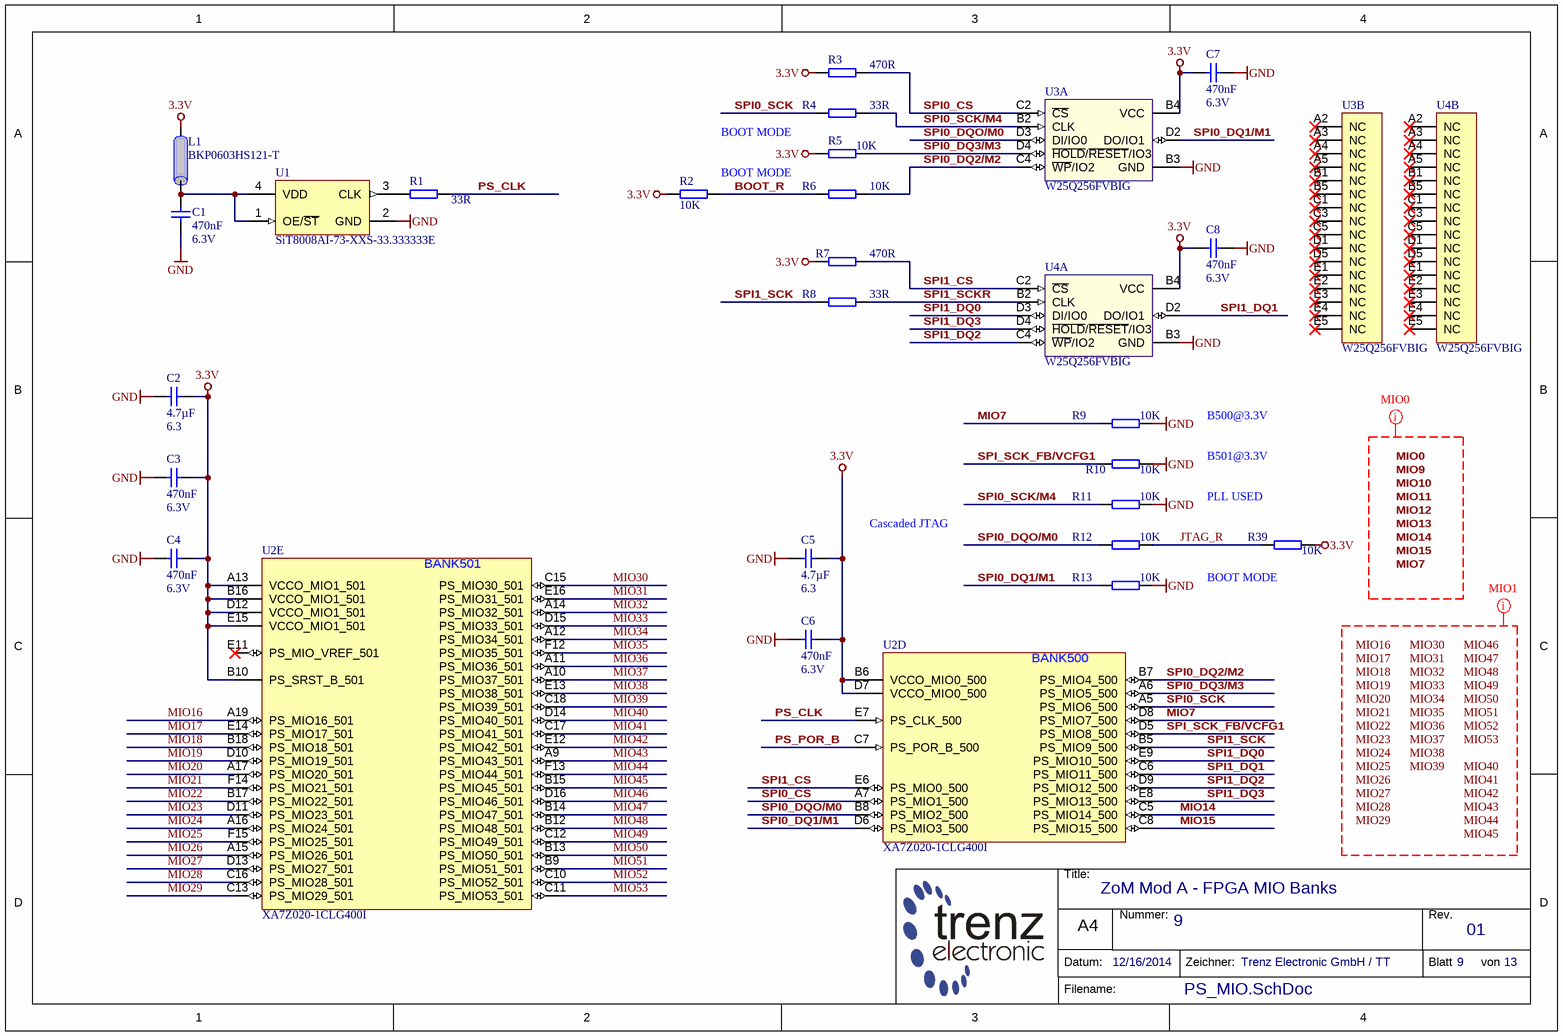
[diagram p9: PS_MIO.SchDoc]

### Parts
C1  470nF  Voltage: 6.3V  [CAPC0603X33N]
C2  4.7µF  Voltage: 6.3  [CAPC1005X60N]
C3  470nF  Voltage: 6.3V  [CAPC0603X33N]
C4  470nF  Voltage: 6.3V  [CAPC0603X33N]
C5  4.7µF  Voltage: 6.3  [CAPC1005X60N]
C6  470nF  Voltage: 6.3V  [CAPC0603X33N]
C7  470nF  Voltage: 6.3V  [CAPC0603X33N]
C8  470nF  Voltage: 6.3V  [CAPC0603X33N]
L1  BKP0603HS121-T  [INDC0603X33N]
R1  33R  [RESC0603X26N]
R2  10K  [RESC0603X26N]
R3  470R  [RESC1005X40N]
R4  33R  [RESC0603X26N]
R5  10K  [RESC0603X26N]
R6  10K  [RESC0603X26N]
R7  470R  [RESC1005X40N]
R8  33R  [RESC0603X26N]
R9  10K  [RESC0603X26N]
R10  10K  [RESC0603X26N]
R11  10K  [RESC0603X26N]
R12  10K  [RESC0603X26N]
R13  10K  [RESC0603X26N]
R39  10K  [RESC0603X26N]
U1  SiT8008AI-73-XXS-33.333333E  [2016]
U2  XA7Z020-1CLG400I  [BGA400C80P20X20_1700X1700X160N]  (parts D,E of 8)
U3  W25Q256FVBIG  [BGA24C100P5X5_800X600X120N]  (parts A,B of 2)
U4  W25Q256FVBIG  [BGA24C100P5X5_800X600X120N]  (parts A,B of 2)

### Nets
3.3V: C2.1 C3.1 C4.1 C5.1 C6.1 C7.1 C8.1 L1.1 R2.2 R3.1 R5.2 R7.2 R39.1 U2.A13(VCCO_MIO1_501) U2.B6(VCCO_MIO0_500) U2.B10(PS_SRST_B_501) U2.B16(VCCO_MIO1_501) U2.D7(VCCO_MIO0_500) U2.D12(VCCO_MIO1_501) U2.E15(VCCO_MIO1_501) U3.B4(VCC) U4.B4(VCC)
GND: C1.2 C2.2 C3.2 C4.2 C5.2 C6.2 C7.2 C8.2 R9.1 R10.1 R11.1 R13.1 U1.2(GND) U3.B3(GND) U4.B3(GND)
BOOT_R: R2.1 R6.2
JTAG_R: R12.1 R39.2
MIO7: R9.2 U2.D8(PS_MIO7_500)
MIO14: U2.C5(PS_MIO14_500)
MIO15: U2.C8(PS_MIO15_500)
MIO16: U2.A19(PS_MIO16_501)
MIO17: U2.E14(PS_MIO17_501)
MIO18: U2.B18(PS_MIO18_501)
MIO19: U2.D10(PS_MIO19_501)
MIO20: U2.A17(PS_MIO20_501)
MIO21: U2.F14(PS_MIO21_501)
MIO22: U2.B17(PS_MIO22_501)
MIO23: U2.D11(PS_MIO23_501)
MIO24: U2.A16(PS_MIO24_501)
MIO25: U2.F15(PS_MIO25_501)
MIO26: U2.A15(PS_MIO26_501)
MIO27: U2.D13(PS_MIO27_501)
MIO28: U2.C16(PS_MIO28_501)
MIO29: U2.C13(PS_MIO29_501)
MIO30: U2.C15(PS_MIO30_501)
MIO31: U2.E16(PS_MIO31_501)
MIO32: U2.A14(PS_MIO32_501)
MIO33: U2.D15(PS_MIO33_501)
MIO34: U2.A12(PS_MIO34_501)
MIO35: U2.F12(PS_MIO35_501)
MIO36: U2.A11(PS_MIO36_501)
MIO37: U2.A10(PS_MIO37_501)
MIO38: U2.E13(PS_MIO38_501)
MIO39: U2.C18(PS_MIO39_501)
MIO40: U2.D14(PS_MIO40_501)
MIO41: U2.C17(PS_MIO41_501)
MIO42: U2.E12(PS_MIO42_501)
MIO43: U2.A9(PS_MIO43_501)
MIO44: U2.F13(PS_MIO44_501)
MIO45: U2.B15(PS_MIO45_501)
MIO46: U2.D16(PS_MIO46_501)
MIO47: U2.B14(PS_MIO47_501)
MIO48: U2.B12(PS_MIO48_501)
MIO49: U2.C12(PS_MIO49_501)
MIO50: U2.B13(PS_MIO50_501)
MIO51: U2.B9(PS_MIO51_501)
MIO52: U2.C10(PS_MIO52_501)
MIO53: U2.C11(PS_MIO53_501)
PS_CLK: R1.2 U2.E7(PS_CLK_500)
PS_POR_B: U2.C7(PS_POR_B_500)
SPI0_CS: R3.2 U2.A7(PS_MIO1_500) U3.C2(~{CS})
SPI0_DQ1/M1: R13.2 U2.D6(PS_MIO3_500) U3.D2(DO/IO1)
SPI0_DQ2/M2: R6.1 U2.B7(PS_MIO4_500) U3.C4(~{WP}/IO2)
SPI0_DQ3/M3: R5.1 U2.A6(PS_MIO5_500) U3.D4(~{HOLD}/~{RESET}/IO3)
SPI0_DQO/M0: R12.2 U2.B8(PS_MIO2_500) U3.D3(DI/IO0)
SPI0_SCK: R4.1 U2.A5(PS_MIO6_500)
SPI0_SCK/M4: R4.2 R11.2 U3.B2(CLK)
SPI1_CS: R7.1 U2.E6(PS_MIO0_500) U4.C2(~{CS})
SPI1_DQ0: U2.E9(PS_MIO10_500) U4.D3(DI/IO0)
SPI1_DQ1: U2.C6(PS_MIO11_500) U4.D2(DO/IO1)
SPI1_DQ2: U2.D9(PS_MIO12_500) U4.C4(~{WP}/IO2)
SPI1_DQ3: U2.E8(PS_MIO13_500) U4.D4(~{HOLD}/~{RESET}/IO3)
SPI1_SCK: R8.1 U2.B5(PS_MIO9_500)
SPI1_SCKR: R8.2 U4.B2(CLK)
SPI_SCK_FB/VCFG1: R10.2 U2.D5(PS_MIO8_500)
NetC1_1: C1.1 L1.2 U1.1(OE/~{ST}) U1.4(VDD)
NetR1_1: R1.1 U1.3(CLK)

Not connected (* = marked no-connect by the designer): U2 E11(PS_MIO_VREF_501)*; U3 A2(NC)* A3(NC)* A4(NC)* A5(NC)* B1(NC)* B5(NC)* C1(NC)* C3(NC)* C5(NC)* D1(NC)* D5(NC)* E1(NC)* E2(NC)* E3(NC)* E4(NC)* E5(NC)*; U4 A2(NC)* A3(NC)* A4(NC)* A5(NC)* B1(NC)* B5(NC)* C1(NC)* C3(NC)* C5(NC)* D1(NC)* D5(NC)* E1(NC)* E2(NC)* E3(NC)* E4(NC)* E5(NC)*

### Layout directives
net class MIO1: MIO16, MIO17, MIO18, MIO19, MIO20, MIO21, MIO22, MIO23, MIO24, MIO25, MIO26, MIO27, MIO28, MIO29, MIO30, MIO31, MIO32, MIO33, MIO34, MIO35, MIO36, MIO37, MIO38, MIO39, MIO40, MIO41, MIO42, MIO43, MIO44, MIO45, MIO46, MIO47, MIO48, MIO49, MIO50, MIO51, MIO52, MIO53
net class MIO0: MIO0, MIO7, MIO9, MIO10, MIO11, MIO12, MIO13, MIO14, MIO15

### Notes on the sheet
- BOOT MODE
- (near R2) BOOT MODE
- B500@3.3V
- B501@3.3V
- PLL USED
- Cascaded JTAG
- (near R39) BOOT MODE
- Labels drawn without touching a wire or pin: MIO0, MIO7, MIO9, MIO10, MIO11, MIO12, MIO13, MIO14, MIO15, MIO16, MIO17, MIO18, MIO19, MIO20, MIO21, MIO22, MIO23, MIO24, MIO25, MIO26, MIO27, MIO28, MIO29, MIO30, MIO31, MIO32, MIO33, MIO34, MIO35, MIO36, MIO37, MIO38, MIO39, MIO40, MIO41, MIO42, MIO43, MIO44, MIO45, MIO46, MIO47, MIO48, MIO49, MIO50, MIO51, MIO52, MIO53
- Title:
- Nummer:
- Rev.
- Datum:
- A4
- Zeichner:
- Blatt
- von
- Filename:
- (in symbol 25981, part D) BANK500
- (in symbol 25981, part E) BANK501

### Library data of the parts
C1 C3 C4 C6-C8 = 24921: as C23 on sheet FPGA-Power; Case: 0603 (0201); Technology: X5R
C2 C5 = 24719: as C49 on sheet FPGA-Power; Case: 1005 (0402); Technology: X5R
L1 = 25393: Ferritdurchführung SMD 0201; AN: 25393; Mixed: SMT; Trenz-Stock: Yes; Case: 0603 (0201); HelpURL: B:\AD\adlib\datasheet\MULTILAYER CHIP BEAD INDUCTORS BK; Preferred: Yes
R1 R4 = 25021: WID SMD 33R 1% 0,05W; AN: 25021; Value: 33; Mixed: SMT; Preferred: Yes; Case: 0603 (0201); HelpURL: B:\AD\adlib\datasheet\R0201
R2 R5 R6 R9-R13 R39 = 24914: WID SMD 10K 1% 0,05W; AN: 24914; Mixed: SMT; Preferred: Yes; Case: 0603 (0201); Value: 10K; HelpURL: B:\AD\adlib\datasheet\R0201; Tolerance: 1%
R3 R7 = 22769: WID SMD 470R 1% 0,063W; AN: 22769; Value: 470; Mixed: SMT; Preferred: Yes; Case: 1005 (0402); Tolerance: 1%
R8 = 25021: WID SMD 33R 1% 0,05W; AN: 25021; Mixed: SMT; Value: 33; Preferred: Yes; Case: 0603 (0201); HelpURL: B:\AD\adlib\datasheet\R0201
U1 = 25023: SiT8008AI-73-XXS-33.333333E MEMS Oszillator 33.333333MHz; AN: 25023; Value: 33M; Trenz-Stock: Yes; Mixed: SMT; Case: 2.0  x 1.6mm; HelpURL: B:\AD\adlib\datasheet\SiT8008; Preferred: Yes
U2 = 25981: AN: 25981; Mixed: SMT; Trenz-Stock: Yes; Case: CLG400; HelpURL: B:\AD\adlib\datasheet\XC7
U3 U4 = 25017: AN: 25017; Trenz-Stock: Yes; Mixed: SMT; Case: TFBGA24; HelpURL: B:\AD\adlib\datasheet\W25Q256FV; Preferred: Yes

## Sheet OBPeripheral.SchDoc: ZoM Mod A - OnBoard Peripherals
size A4; Organization: Trenz Electronic GmbH; DocumentNumber: 4; Revision: 01; SheetNumber: 4; SheetTotal: 13; Date: 12/16/2014
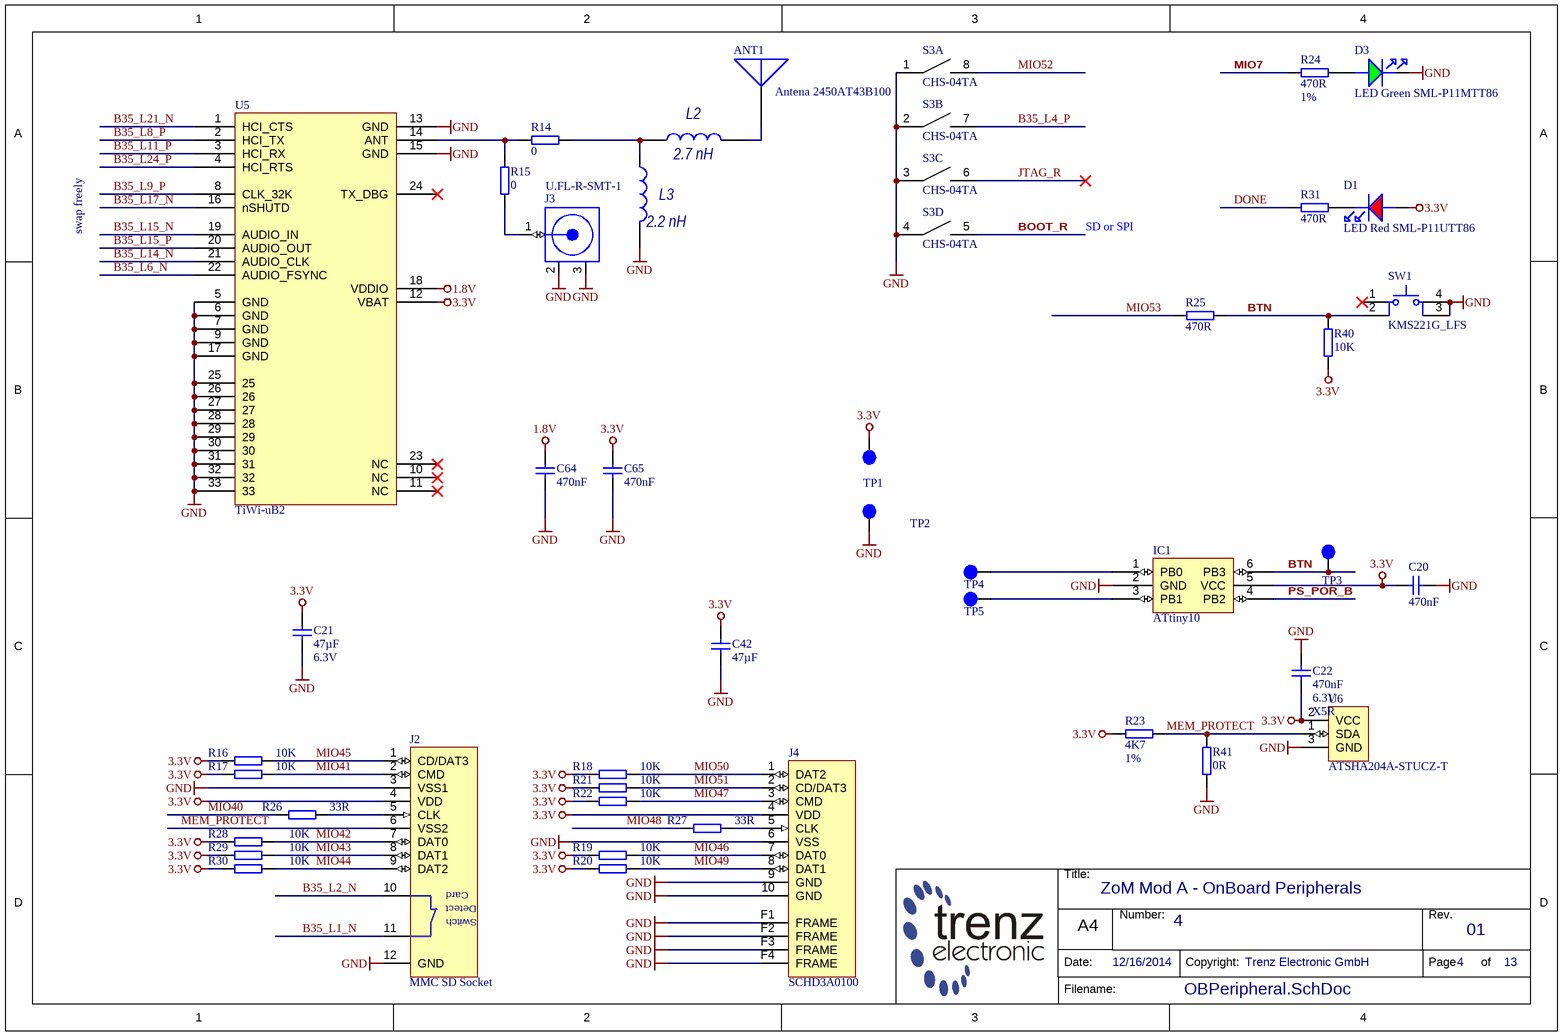
[diagram p10: OBPeripheral.SchDoc]

### Parts
ANT1  Antena 2450AT43B100  [Antena 2450AT43B100]
C20  470nF  [CAPC0603X33N]
C21  47µF  Voltage: 6.3V  [CAPC3216X180N]
C22  470nF  Voltage: 6.3V  Technology: X5R  [CAPC0603X33N]
C42  47µF  [CAPC3216X180N]
C64  470nF  [CAPC0603X33N]
C65  470nF  [CAPC0603X33N]
D1  LED Red SML-P11UTT86  [LEDC1006X25N_RED]
D3  LED Green SML-P11MTT86  [LEDC1006X25N_GREEN]
IC1  value ATtiny10  [SOT23-6]  (hidden comment: Atmel AVR ATtiny10)
J2  MMC SD Socket  [104C-TAA0-R]
J3  U.FL-R-SMT-1  [U.FL-R-SMT-1]
J4  SCHD3A0100  [SCHD3A0100]
L2  US_VisibleSCH: 2.7 nH  [RESC1005X40R]  (hidden comment: IND-Ferrite)
L3  US_VisibleSCH: 2.2 nH  [RESC1005X40R]  (hidden comment: IND-Ferrite)
R14  0  [RESC0603X26N]
R15  0  [RESC0603X26N]
R16  10K  [RESC0603X26N]
R17  10K  [RESC0603X26N]
R18  10K  [RESC0603X26N]
R19  10K  [RESC0603X26N]
R20  10K  [RESC0603X26N]
R21  10K  [RESC0603X26N]
R22  10K  [RESC0603X26N]
R23  4K7  Tolerance: 1%  [RESC0603X26N]
R24  470R  Tolerance: 1%  [RESC1005X40N]
R25  470R  [RESC1005X40N]
R26  33R  [RESC0603X26N]
R27  33R  [RESC0603X26N]
R28  10K  [RESC0603X26N]
R29  10K  [RESC0603X26N]
R30  10K  [RESC0603X26N]
R31  470R  [RESC1005X40N]
R40  10K  [RESC0603X26N]
R41  0R  [RESC1005X40N]
S3  CHS-04TA  [CHS-04TA]  (parts A,B,C,D of 4)
SW1  value KMS221G_LFS  [KMS221G_LFS]  (hidden comment: 4pin button)
TP1  TP  [TP-SMD-2mm]  (value not drawn)  (no BOM)
TP2  TP  [TP-SMD-2mm]  (value not drawn)  (no BOM)
TP3  TP  [TP-SMD-2mm]  (value not drawn)  (no BOM)
TP4  TP  [TP-SMD-2mm]  (value not drawn)  (no BOM)
TP5  TP  [TP-SMD-2mm]  (value not drawn)  (no BOM)
U5  TiWi-uB2  [TiWi-uB2]
U6  ATSHA204A-STUCZ-T  [SOT95P237X112-3N]

### Nets
1.8V: C64.1 U5.18(VDDIO)
3.3V: C20.1 C21.1 C22.2 C42.1 C65.1 D1.A IC1.5(VCC) J2.4(VDD) J4.4(VDD) R16.1 R17.1 R18.1 R19.1 R20.1 R21.1 R22.1 R23.2 R28.1 R29.1 R30.1 R40.2 TP1.1 U5.12(VBAT) U6.2(VCC)
GND: C20.2 C21.2 C22.1 C42.2 C64.2 C65.2 D3.K IC1.2(GND) J2.3(VSS1) J2.12(GND) J3.2(GND) J3.3(GND) J4.6(VSS) J4.9(GND) J4.10(GND) J4.F1(FRAME) J4.F2(FRAME) J4.F3(FRAME) J4.F4(FRAME) L3.2 R41.2 S3.1 S3.2 S3.3 S3.4 SW1.3 SW1.4 TP2.1 U5.5(GND) U5.6(GND) U5.7(GND) U5.9(GND) U5.13(GND) U5.15(GND) U5.17(GND) U5.25 U5.26 U5.27 U5.28 U5.29 U5.30 U5.31 U5.32 U5.33 U6.3(GND)
B35_L1_N: J2.11
B35_L2_N: J2.10
B35_L4_P: S3.7
B35_L6_N: U5.22(AUDIO_FSYNC)
B35_L8_P: U5.2(HCI_TX)
B35_L9_P: U5.8(CLK_32K)
B35_L11_P: U5.3(HCI_RX)
B35_L14_N: U5.21(AUDIO_CLK)
B35_L15_N: U5.19(AUDIO_IN)
B35_L15_P: U5.20(AUDIO_OUT)
B35_L17_N: U5.16(nSHUTD)
B35_L21_N: U5.1(HCI_CTS)
B35_L24_P: U5.4(HCI_RTS)
BOOT_R: S3.5
BTN: IC1.6(PB3) R25.1 R40.1 SW1.2 TP3.1
DONE: R31.2
JTAG_R: S3.6
MEM_PROTECT: J2.6(VSS2) R23.1 R41.1 U6.1(SDA)
MIO7: R24.2
MIO40: R26.1
MIO41: J2.2(CMD) R17.2
MIO42: J2.7(DAT0) R28.2
MIO43: J2.8(DAT1) R29.2
MIO44: J2.9(DAT2) R30.2
MIO45: J2.1(CD/DAT3) R16.2
MIO46: J4.7(DAT0) R19.2
MIO47: J4.3(CMD) R22.2
MIO48: R27.1
MIO49: J4.8(DAT1) R20.2
MIO50: J4.1(DAT2) R18.2
MIO51: J4.2(CD/DAT3) R21.2
MIO52: S3.8
MIO53: R25.2
PS_POR_B: IC1.4(PB2)
NetANT1_1: ANT1.1(Feed_Point) L2.2
NetD1_K: D1.K R31.1
NetD3_A: D3.A R24.1
NetIC1_1: IC1.1(PB0) TP4.1
NetIC1_3: IC1.3(PB1) TP5.1
NetJ2_5: J2.5(CLK) R26.2
NetJ3_1: J3.1(Signal) R15.1
NetJ4_5: J4.5(CLK) R27.2
NetL2_1: L2.1 L3.1 R14.2
NetR14_1: R14.1 R15.2 U5.14(ANT)

Not connected (* = marked no-connect by the designer): SW1 1*; U5 10(NC)* 11(NC)* 23(NC)* 24(TX_DBG)*

### Notes on the sheet
- swap freely
- SD or SPI
- Title:
- Number:
- Rev.
- Date:
- A4
- Copyright:
- Page
- of
- Filename:
- (in symbol 24818) Card; Detect; Switch

### Library data of the parts
C20 C22 C64 C65 = 24921: as C23 on sheet FPGA-Power; Case: 0603 (0201)
  C20 C64 C65: Voltage: 6.3V; Technology: X5R
C21 C42 = 24557: as C9 on sheet B34; Technology: X5R; Case: 3216 (1206); Tolerance: 20%
  C42: Voltage: 6.3V
D1 = 24212: LED Rot SML-P11UTT86 SMD; AN: 24212; Mixed: SMT; Preferred: Yes; Case: 1005 (0402); HelpURL: B:\AD\adlib\datasheet\SML-P1
D3 = 24211: LED Grün SML-P11MTT86 SMD; AN: 24211; Mixed: SMT; Preferred: Yes; Case: 1005 (0402); HelpURL: B:\AD\adlib\datasheet\SML-P1
IC1 = ATtiny10: ID: 9; Component: ATtiny10
J2 = 24818: MCC SD Socket; AN: 24818; Trenz-Stock: Yes; Mixed: SMT; Case: MMC SD; HelpURL: B:\AD\adlib\datasheet\104C-TAA0-R
J3 = 25605: Hirose Ultra Small Coaxial Connector; AN: 25605; Mixed: SMT; HelpURL: B:\AD\adlib\datasheet\U.FL
J4 = 24993: microSD Card (Header Type) SCHD Series; AN: 24993; Trenz-Stock: Yes; Mixed: SMT; Case: microSD; HelpURL: B:\AD\adlib\datasheet\SCHD3A0100
L2 L3 = IND-Ferrite: Ferrite Inductor
R14 R15 = 25021: WID SMD 0; AN: 25021; Mixed: SMT; Value: 33; Preferred: Yes; Case: 0603 (0201); HelpURL: B:\AD\adlib\datasheet\R0201
R16-R22 R28-R30 R40 = 24914: as R2 on sheet PS_MIO; Tolerance: 1%; Case: 0603 (0201); Value: 10K; HelpURL: B:\AD\adlib\datasheet\R0201
R23 = 25242: as R37 on sheet FPGA-Misc; Case: 0603 (0201); HelpURL: B:\AD\adlib\datasheet\R0201
R24 R25 R31 = 22769: as R3 on sheet PS_MIO; Case: 1005 (0402)
  R25 R31: Tolerance: 1%
R26 R27 = 25021: as R8 on sheet PS_MIO; Case: 0603 (0201); HelpURL: B:\AD\adlib\datasheet\R0201
R41 = 22738: WID SMD 0R; AN: 22738; Mixed: SMT; Value: 0; Preferred: Yes; Case: 1005 (0402)
S3 = 23417: DIP Schalter 4 fach 1,27mm SMD; AN: 23417; Trenz-Stock: Yes; Mixed: SMT; HelpURL: B:\AD\adlib\datasheet\CHS; Preferred: Yes
SW1 = KMS221G_LFS: ID: 6; Component: RA-SMD-BUTTON; Case: *; FARNELL: *
TP1-TP5 = TP-SMD-2mm: Testpoint; ID: 4; Value: TP-SMD-2mm; Component: TP-SMD-2mm
U6 = 26027: AN: 26027; Mixed: SMT; Trenz-Stock: Yes; Case: SOT23-3; HelpURL: B:\AD\adlib\datasheet\ATSHA204

## Sheet POWER.SchDoc: ZoM Mod A - Power
size A4; Organization: Trenz Electronic GmbH; DocumentNumber: 13; Revision: 01; SheetNumber: 13; SheetTotal: 13; Date: 12/16/2014
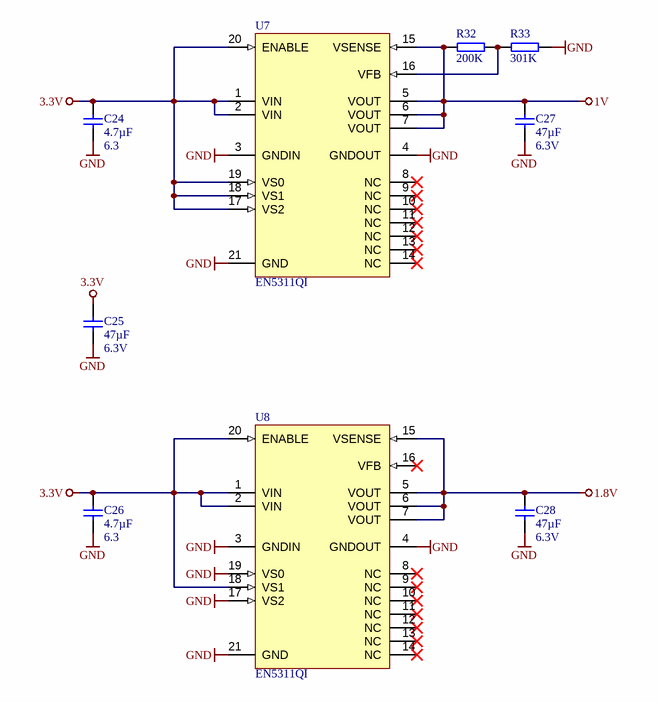
[diagram p11: POWER.SchDoc]

### Parts
C24  4.7µF  Voltage: 6.3  [CAPC1005X60N]
C25  47µF  Voltage: 6.3V  [CAPC3216X180N]
C26  4.7µF  Voltage: 6.3  [CAPC1005X60N]
C27  47µF  Voltage: 6.3V  [CAPC3216X180N]
C28  47µF  Voltage: 6.3V  [CAPC3216X180N]
R32  200K  [RESC1005X40N]
R33  301K  [RESC1005X40N]
U7  EN5311QI  [EN5311QI]
U8  EN5311QI  [EN5311QI]

### Nets
1.8V: C28.1 U8.5(VOUT) U8.6(VOUT) U8.7(VOUT) U8.15(VSENSE)
1V: C27.1 R32.1 U7.5(VOUT) U7.6(VOUT) U7.7(VOUT) U7.15(VSENSE)
3.3V: C24.1 C25.1 C26.1 U7.1(VIN) U7.2(VIN) U7.17(VS2) U7.18(VS1) U7.19(VS0) U7.20(ENABLE) U8.1(VIN) U8.2(VIN) U8.18(VS1) U8.20(ENABLE)
GND: C24.2 C25.2 C26.2 C27.2 C28.2 R33.2 U7.3(GNDIN) U7.4(GNDOUT) U7.21(GND) U8.3(GNDIN) U8.4(GNDOUT) U8.17(VS2) U8.19(VS0) U8.21(GND)
NetR32_2: R32.2 R33.1 U7.16(VFB)

Not connected (* = marked no-connect by the designer): U7 8(NC)* 9(NC)* 10(NC)* 11(NC)* 12(NC)* 13(NC)* 14(NC)*; U8 8(NC)* 9(NC)* 10(NC)* 11(NC)* 12(NC)* 13(NC)* 14(NC)* 16(VFB)*

### Notes on the sheet
- Title:
- Number:
- Rev.
- Date:
- A4
- Copyright:
- Page
- of
- Filename:

### Library data of the parts
C24 C26 = 24719: as C63 on sheet FPGA-Power; Technology: X5R; Case: 1005 (0402)
C25 C27 C28 = 24557: as C9 on sheet B34; Technology: X5R; Case: 3216 (1206); Tolerance: 20%
R32 = 23846: WID SMD 200K 1% 0,063W; AN: 23846; Mixed: SMT; Preferred: Yes; Case: 1005 (0402); Value: 200K
R33 = 26224: WID SMD 301K 1% 0,063W; AN: 26224; Mixed: SMT; Tolerance: 1%; Case: 1005 (0402); Value: 301k
U7 U8 = 25492: AN: 25492; Mixed: SMT; Trenz-Stock: Yes; Case: QFN20; HelpURL: B:\AD\adlib\datasheet\EN5311QI; Preferred: Yes

## Nets that join several sheets
1.8V: FPGA-Power (22 pins), FPGA-Misc (C32.2 C33.2 U2.F11 U2.J9), B35 (11 pins), PS-DDR (10 pins), OBPeripheral (C64.1 U5.18), POWER (5 pins)
1V: FPGA-Power (35 pins), POWER (6 pins)
3.3V: FPGA-Misc (9 pins), B34 (14 pins), PS_MIO (22 pins), OBPeripheral (24 pins), POWER (13 pins)
GND: TE0719 (H1.1 H4.1), FPGA-Power (89 pins), FPGA-Misc (9 pins), B13 (5 pins), B34 (7 pins), B35 (C16.2 C17.2 C18.2 C19.2), PS_MIO (15 pins), OBPeripheral (45 pins), POWER (14 pins)
B35_L1_N: B35 (U2.B20), OBPeripheral (J2.11)
B35_L2_N: B35 (U2.A20), OBPeripheral (J2.10)
B35_L4_P: B35 (U2.D19), OBPeripheral (S3.7)
B35_L6_N: B35 (U2.F17), OBPeripheral (U5.22)
B35_L8_P: B35 (U2.M17), OBPeripheral (U5.2)
B35_L9_P: B35 (U2.L19), OBPeripheral (U5.8)
B35_L11_P: B35 (U2.L16), OBPeripheral (U5.3)
B35_L14_N: B35 (U2.H18), OBPeripheral (U5.21)
B35_L15_N: B35 (U2.F20), OBPeripheral (U5.19)
B35_L15_P: B35 (U2.F19), OBPeripheral (U5.20)
B35_L17_N: B35 (U2.H20), OBPeripheral (U5.16)
B35_L21_N: B35 (U2.N16), OBPeripheral (U5.1)
B35_L24_P: B35 (U2.K16), OBPeripheral (U5.4)
BOOT_R: PS_MIO (R2.1 R6.2), OBPeripheral (S3.5)
DONE: FPGA-Misc (R36.2 U2.R11), OBPeripheral (R31.2)
JTAG_R: PS_MIO (R12.1 R39.2), OBPeripheral (S3.6)
MIO7: PS_MIO (R9.2 U2.D8), OBPeripheral (R24.2)
MIO40: PS_MIO (U2.D14), OBPeripheral (R26.1)
MIO41: PS_MIO (U2.C17), OBPeripheral (J2.2 R17.2)
MIO42: PS_MIO (U2.E12), OBPeripheral (J2.7 R28.2)
MIO43: PS_MIO (U2.A9), OBPeripheral (J2.8 R29.2)
MIO44: PS_MIO (U2.F13), OBPeripheral (J2.9 R30.2)
MIO45: PS_MIO (U2.B15), OBPeripheral (J2.1 R16.2)
MIO46: PS_MIO (U2.D16), OBPeripheral (J4.7 R19.2)
MIO47: PS_MIO (U2.B14), OBPeripheral (J4.3 R22.2)
MIO48: PS_MIO (U2.B12), OBPeripheral (R27.1)
MIO49: PS_MIO (U2.C12), OBPeripheral (J4.8 R20.2)
MIO50: PS_MIO (U2.B13), OBPeripheral (J4.1 R18.2)
MIO51: PS_MIO (U2.B9), OBPeripheral (J4.2 R21.2)
MIO52: PS_MIO (U2.C10), OBPeripheral (S3.8)
MIO53: PS_MIO (U2.C11), OBPeripheral (R25.2)
PS_POR_B: PS_MIO (U2.C7), OBPeripheral (IC1.4)